# EAGLE design capstone (EAGLE 9.4.0)

## Sheet 1 of 6: Block Diagram
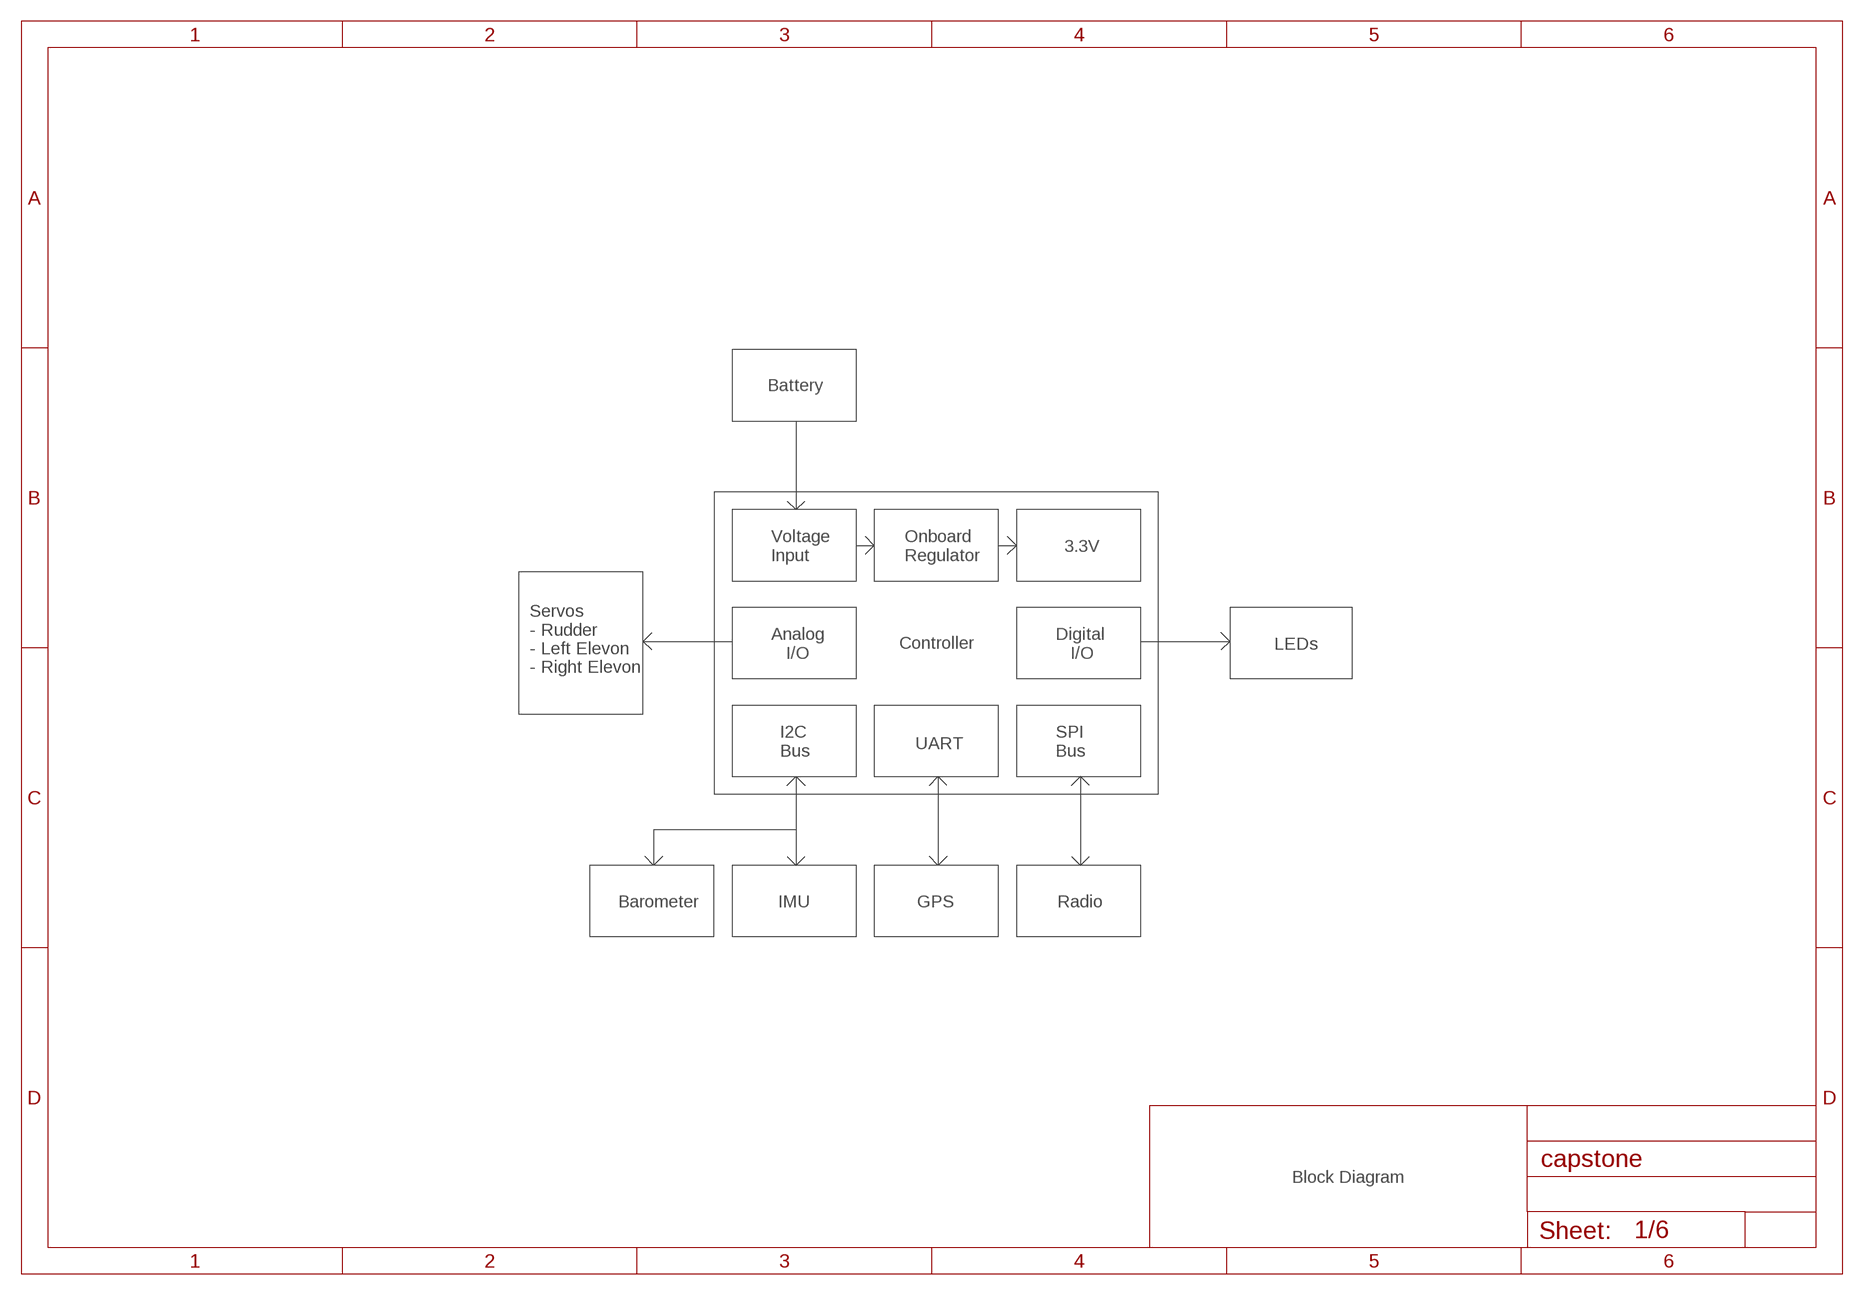
[diagram p0: schematic, sheet 1]

### Notes on the sheet
- Battery
- 3.3V
- Voltage
  Input
- Onboard
  Regulator
- LEDs
- Analog
     I/O
- Digital
     I/O
- Controller
- Servos
  - Rudder
  - Left Elevon
  - Right Elevon
- UART
- I2C
  Bus
- SPI
  Bus
- Barometer | IMU | GPS | Radio
- Block Diagram

## Sheet 2 of 6: Teensy 3.2 Connection
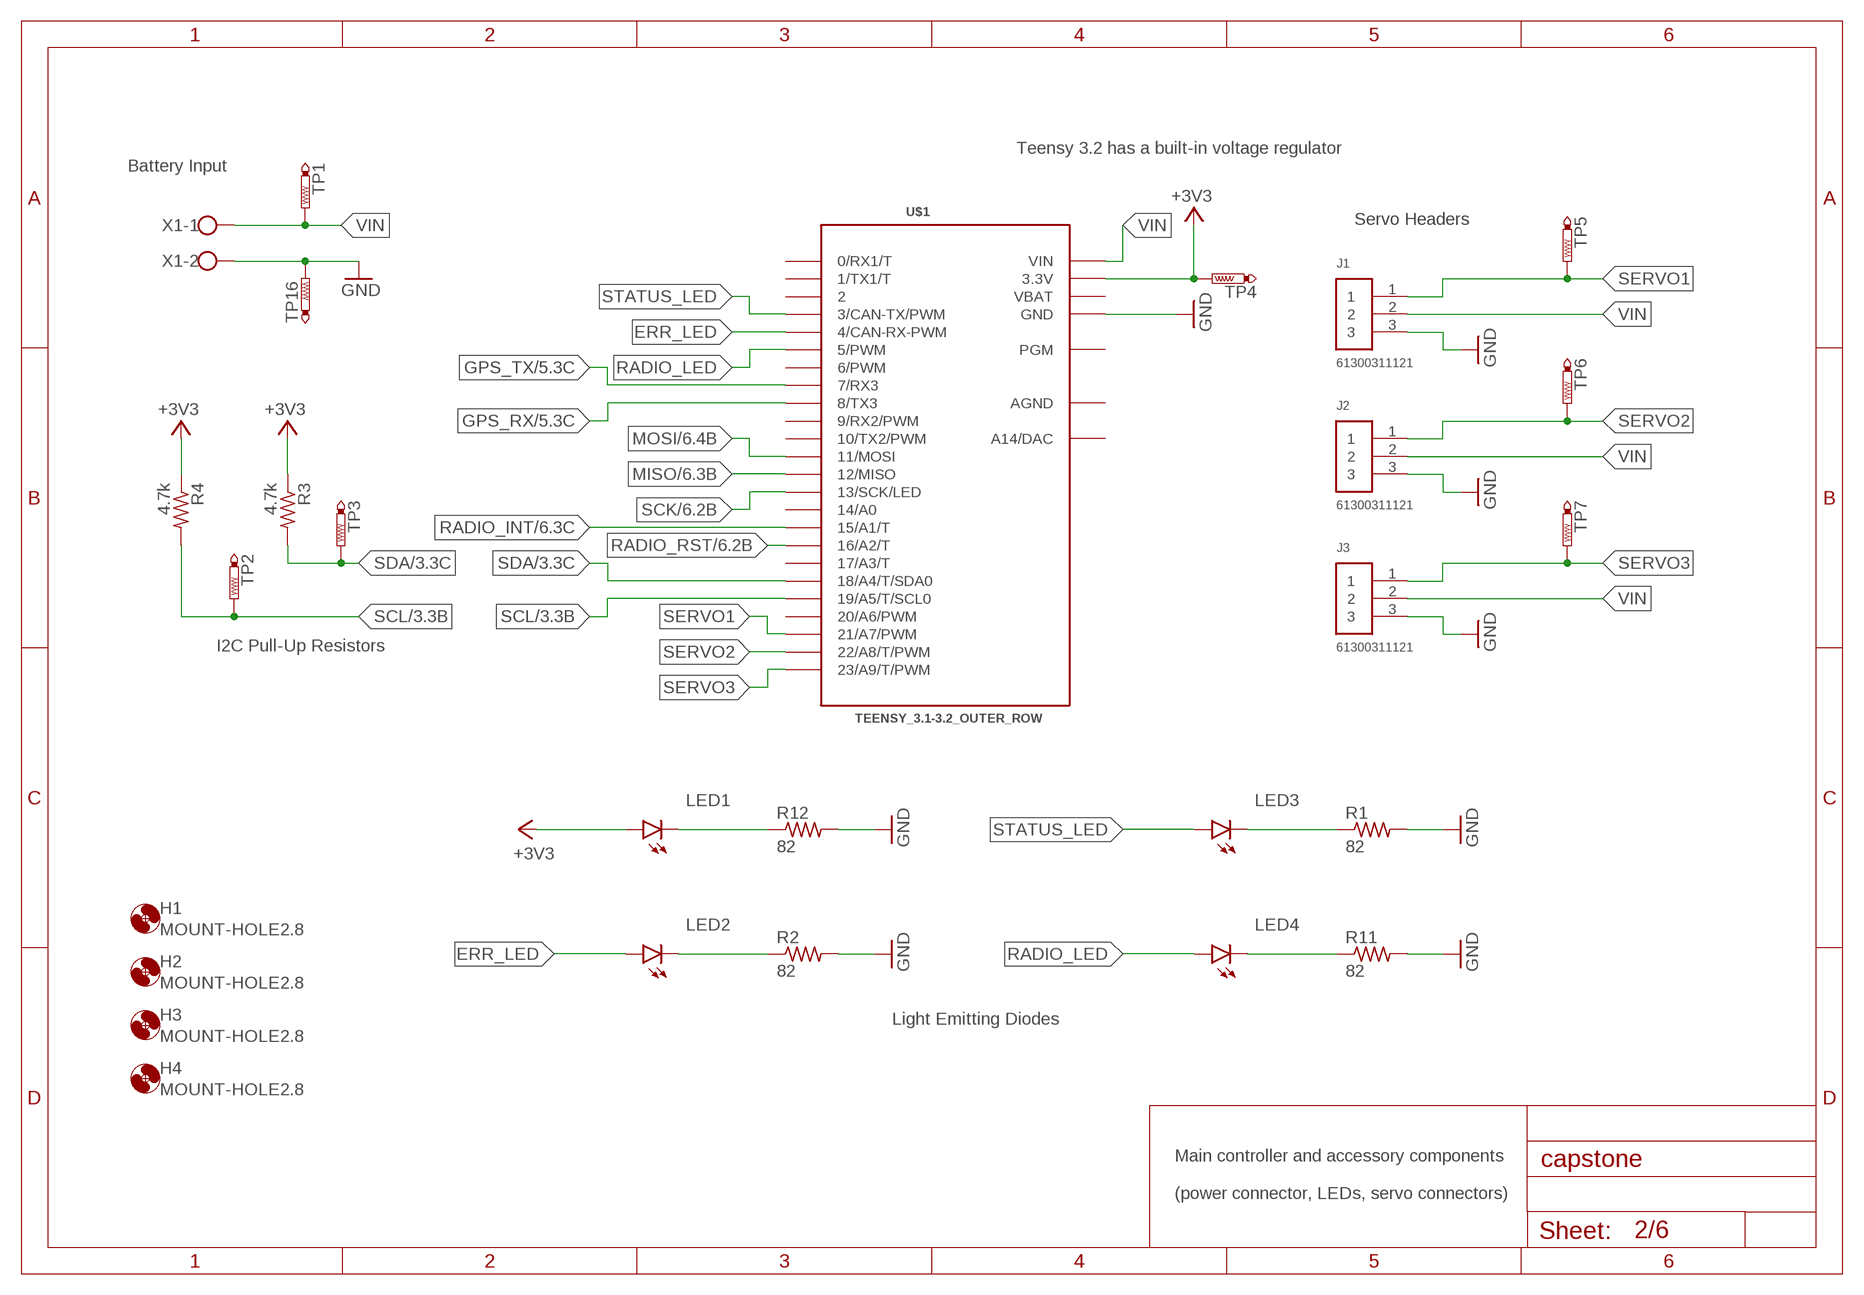
[diagram p1: schematic, sheet 2]

### Parts
H1  MOUNT-HOLE2.8  [2,8]
H2  MOUNT-HOLE2.8  [2,8]
H3  MOUNT-HOLE2.8  [2,8]
H4  MOUNT-HOLE2.8  [2,8]
J1  61300311121  [61300311121]
J2  61300311121  [61300311121]
J3  61300311121  [61300311121]
LED1  HSMH-C190  [LED-0603]
LED2  HSMH-C190  [LED-0603]
LED3  HSMH-C190  [LED-0603]
LED4  HSMH-C190  [LED-0603]
R1  82  R-US_R0603  [R0603]
R2  82  R-US_R0603  [R0603]
R3  4.7k  R-US_R0603  [R0603]
R4  4.7k  R-US_R0603  [R0603]
R11  82  R-US_R0603  [R0603]
R12  82  R-US_R0603  [R0603]
TP1  PTR1B1,27  [B1,27]
TP2  PTR1B1,27  [B1,27]
TP3  PTR1B1,27  [B1,27]
TP4  PTR1B1,27  [B1,27]
TP5  PTR1B1,27  [B1,27]
TP6  PTR1B1,27  [B1,27]
TP7  PTR1B1,27  [B1,27]
TP16  PTR1B1,27  [B1,27]
U$1  TEENSY_3.1-3.2_OUTER_ROW  [TEENSY_3.0-3.2&LC_OUTER_ROW]
X1  W237-102  [W237-102]

### Nets
+3V3: LED1.A R3.1 R4.1 TP4.TP U$1.3.3V U$1.3.3V1(3.3V) ; also sheet 3,4,5,6
ERR_LED: LED2.A U$1.4(4/CAN-RX-PWM)
GND: J1.3 J2.3 J3.3 R1.2 R2.2 R11.2 R12.2 TP16.TP U$1.GND U$1.GND1(GND) X1.2 ; also sheet 3,4,5,6
GPS_RX: U$1.8(8/TX3) ; also sheet 5
GPS_TX: U$1.7(7/RX3) ; also sheet 5
MISO: U$1.12(12/MISO) ; also sheet 6
MOSI: U$1.11(11/MOSI) ; also sheet 6
N$6: LED1.C R12.1
N$7: LED2.C R2.1
N$9: LED4.C R11.1
N$10: LED3.C R1.1
RADIO_INT: U$1.15/A1(15/A1/T) ; also sheet 6
RADIO_LED: LED4.A U$1.5(5/PWM)
RADIO_RST: U$1.16/A2(16/A2/T) ; also sheet 6
SCK: U$1.13(13/SCK/LED) ; also sheet 6
SCL: R4.2 TP2.TP U$1.19/A5(19/A5/T/SCL0) ; also sheet 3,4
SDA: R3.2 TP3.TP U$1.18/A4(18/A4/T/SDA0) ; also sheet 3,4
SERVO1: J1.1 TP5.TP U$1.21/A7(21/A7/PWM)
SERVO2: J2.1 TP6.TP U$1.22/A8(22/A8/T/PWM)
SERVO3: J3.1 TP7.TP U$1.23/A9(23/A9/T/PWM)
STATUS_LED: LED3.A U$1.3(3/CAN-TX/PWM)
VIN: J1.2 J2.2 J3.2 TP1.TP U$1.VIN X1.1
Unconnected: U$1.0(0/RX1/T) U$1.1(1/TX1/T) U$1.2 U$1.6(6/PWM) U$1.9(9/RX2/PWM) U$1.10(10/TX2/PWM) U$1.14/A0 U$1.17/A3(17/A3/T) U$1.20/A6(20/A6/PWM) U$1.PGM U$1.RESET/DAC(A14/DAC)

### Notes on the sheet
- Teensy 3.2 has a built-in voltage regulator
- Battery Input
- Servo Headers
- I2C Pull-Up Resistors
- Light Emitting Diodes
- Main controller and accessory components
  
  (power connector, LEDs, servo connectors)

## Sheet 3 of 6: BMP-388 Connection
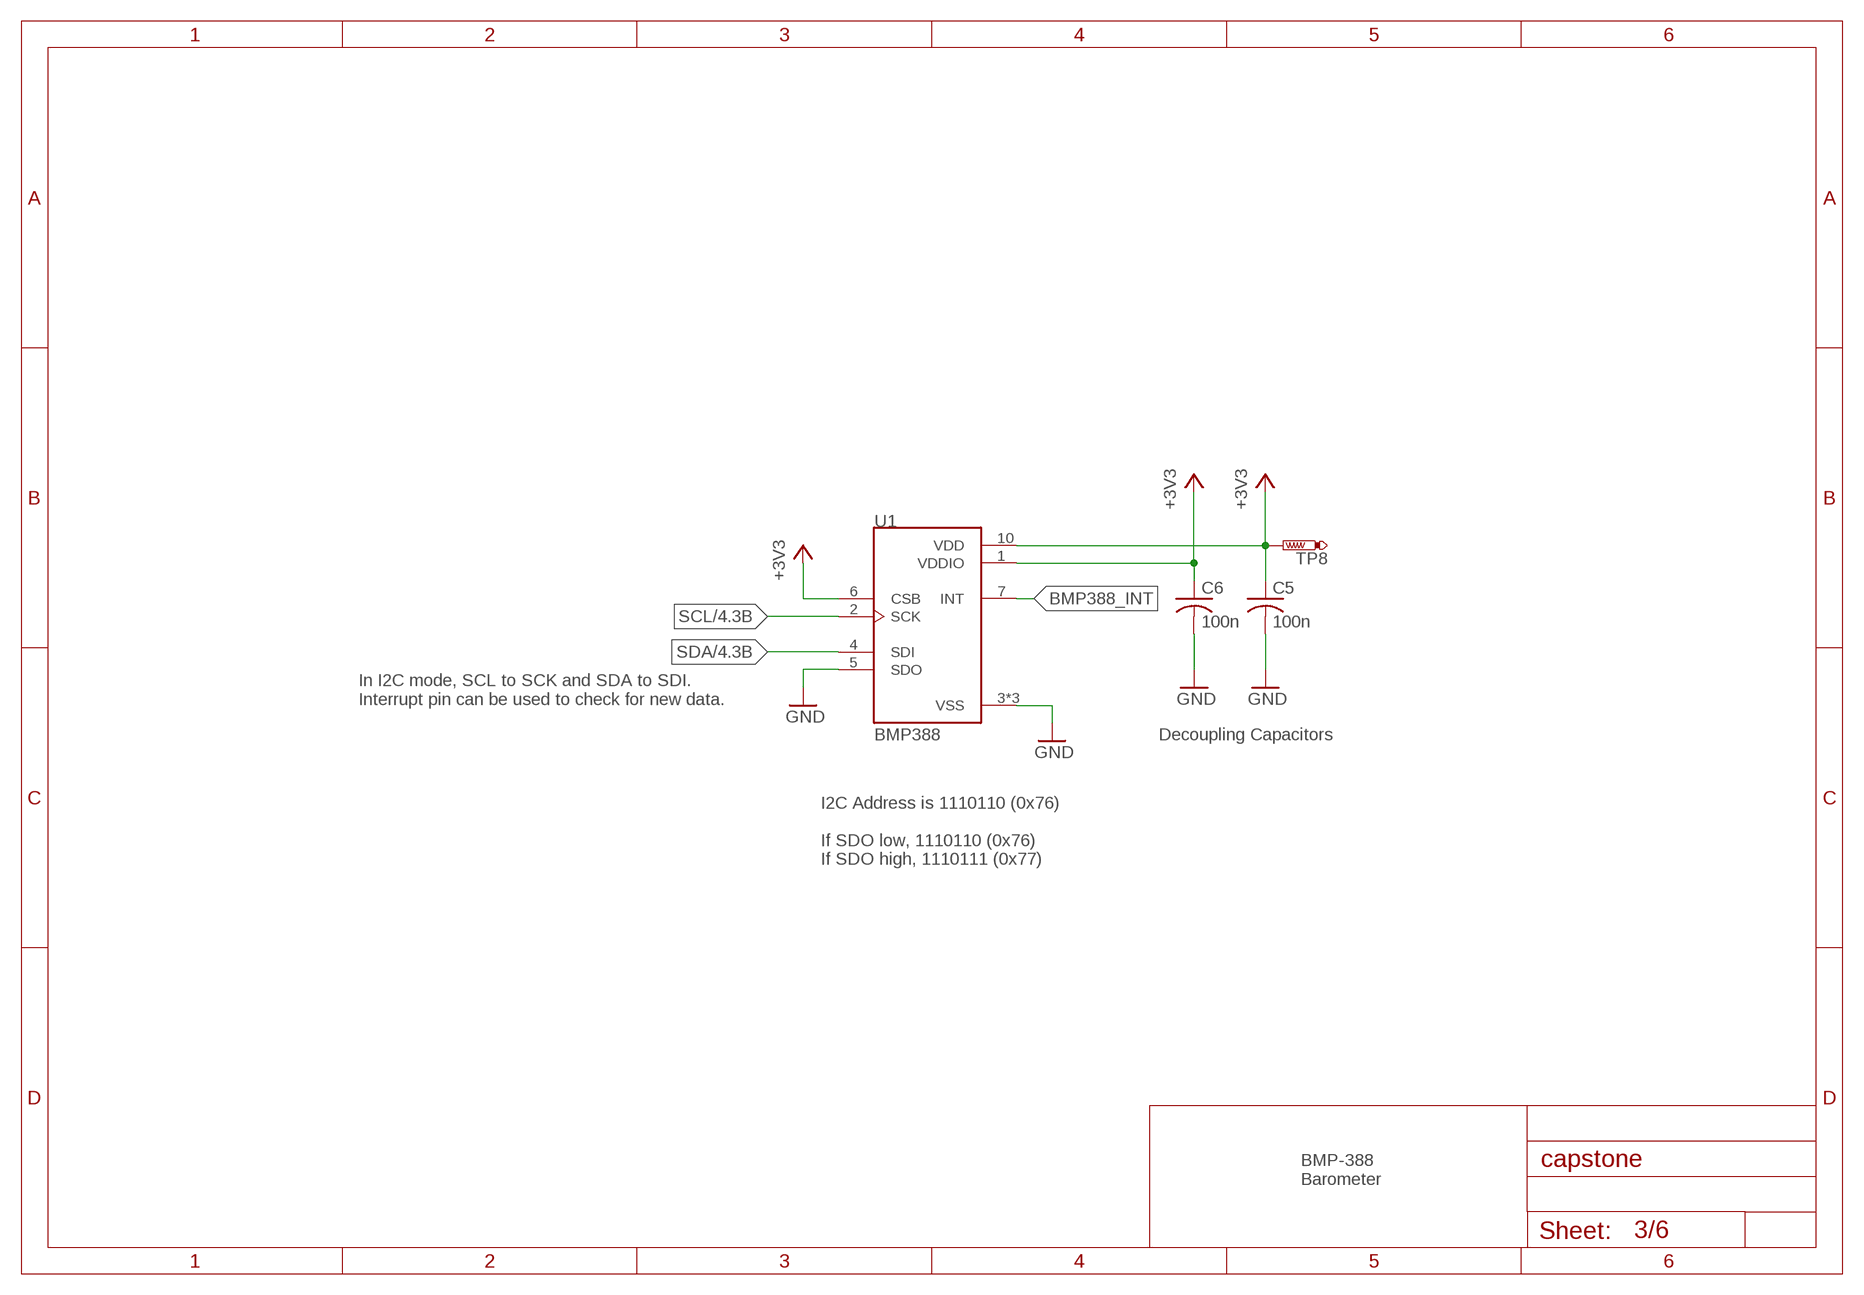
[diagram p2: schematic, sheet 3]

### Parts
C5  100n  C-USC0603  [C0603]
C6  100n  C-USC0603  [C0603]
TP8  PTR1B1,27  [B1,27]
U1  BMP388  [PQFN50P200X200X80-10N]

### Nets
+3V3: C5.1 C6.1 TP8.TP U1.1(VDDIO) U1.6(CSB) U1.10(VDD) ; also sheet 2,4,5,6
BMP388_INT: U1.7(INT)
GND: C5.2 C6.2 U1.3(VSS) U1.5(SDO) U1.8(VSS) U1.9(VSS) ; also sheet 2,4,5,6
SCL: U1.2(SCK) ; also sheet 2,4
SDA: U1.4(SDI) ; also sheet 2,4

### Notes on the sheet
- In I2C mode, SCL to SCK and SDA to SDI. 
  Interrupt pin can be used to check for new data.
- Decoupling Capacitors
- I2C Address is 1110110 (0x76)
  
  If SDO low, 1110110 (0x76)
  If SDO high, 1110111 (0x77)
- BMP-388
  Barometer

## Sheet 4 of 6: LSM9DS1 Connection
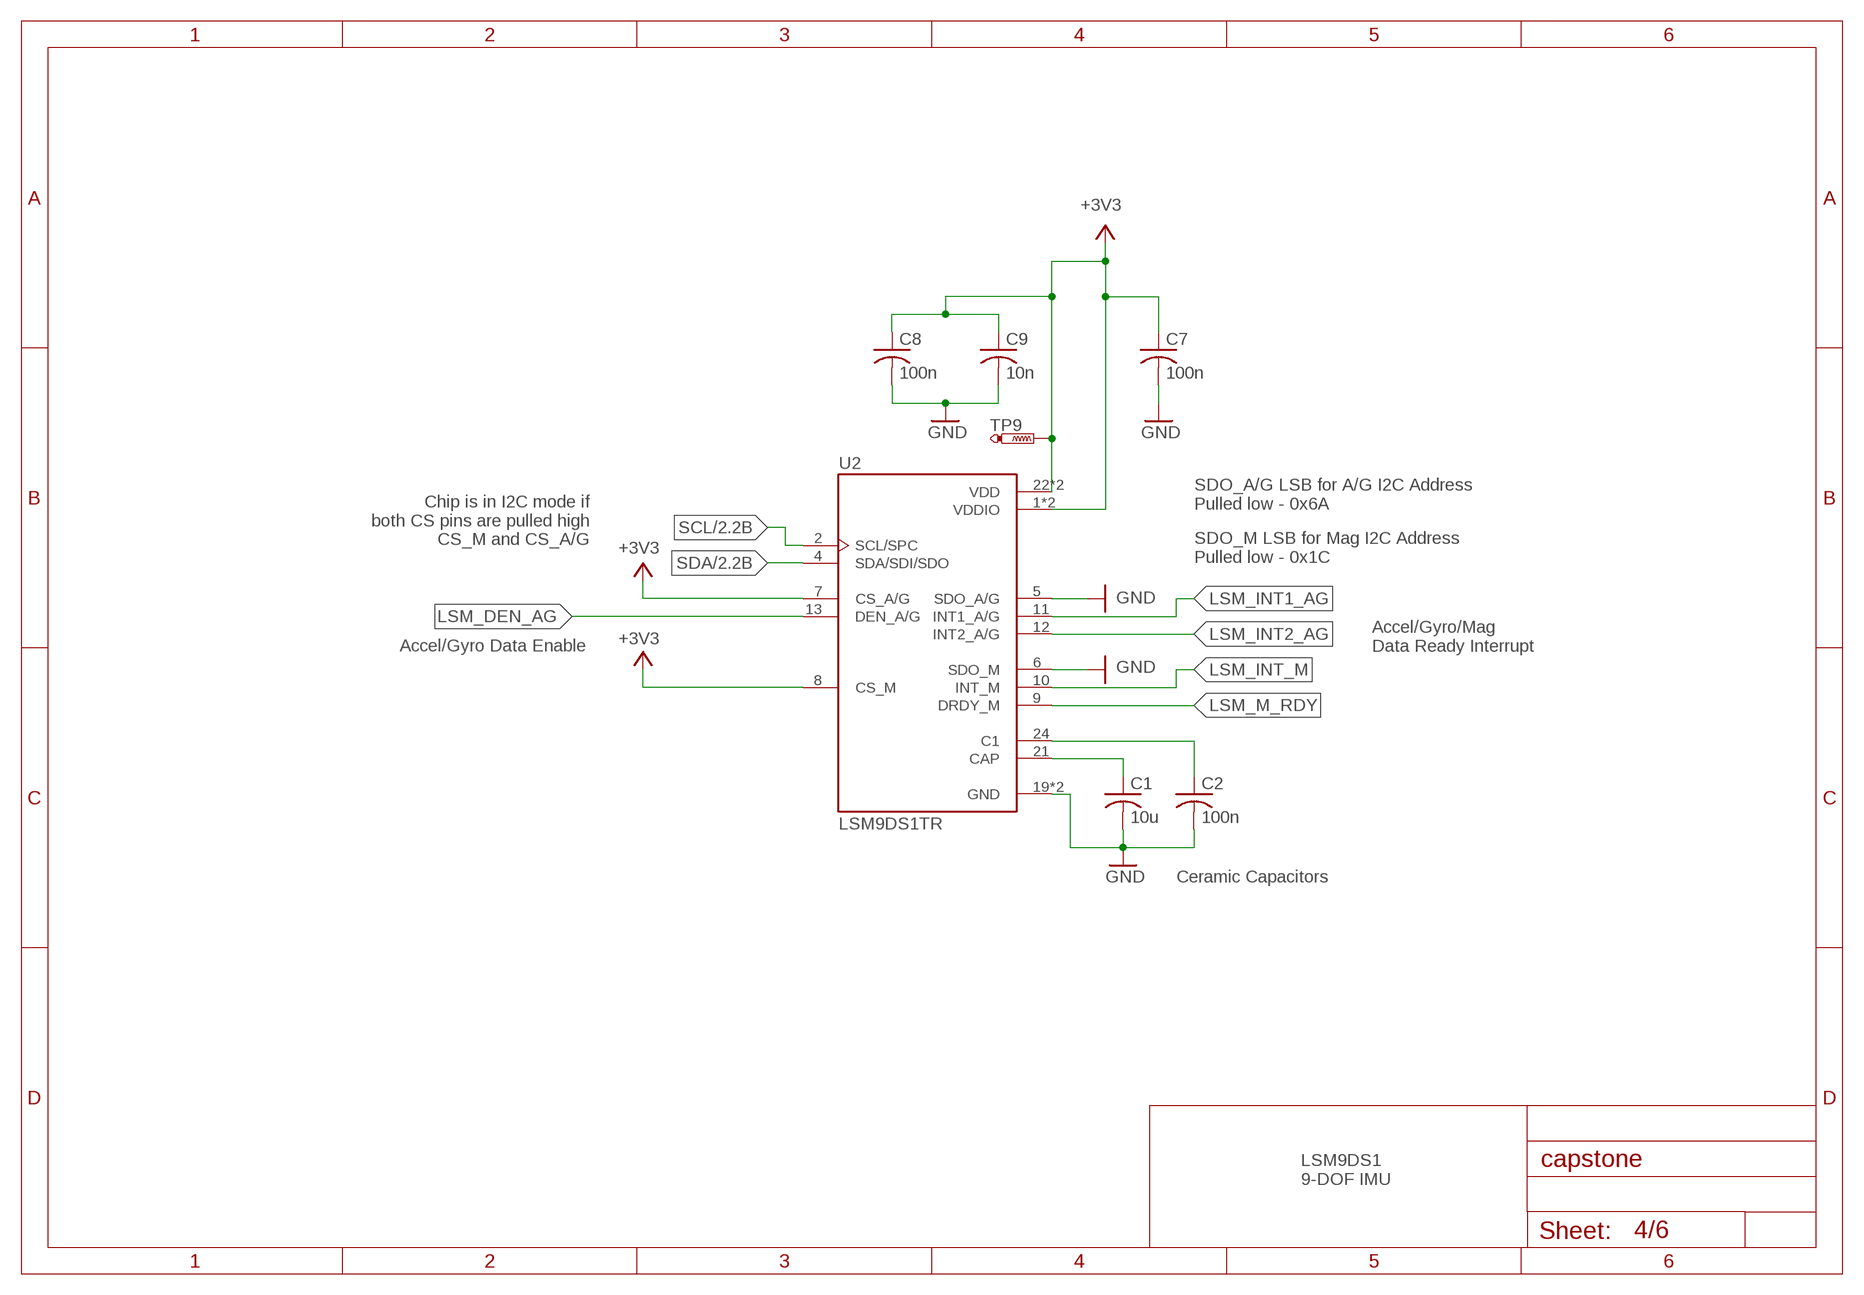
[diagram p3: schematic, sheet 4]

### Parts
C1  10u  C-USC0603  [C0603]
C2  100n  C-USC0603  [C0603]
C7  100n  C-USC0603  [C0603]
C8  100n  C-USC0603  [C0603]
C9  10n  C-USC0603  [C0603]
TP9  PTR1B1,27  [B1,27]
U2  LSM9DS1TR  [PQFN43P300X350X102-24N]

### Nets
+3V3: C7.1 C8.1 C9.1 TP9.TP U2.1(VDDIO) U2.3(VDDIO) U2.7(CS_A/G) U2.8(CS_M) U2.22(VDD) U2.23(VDD) ; also sheet 2,3,5,6
GND: C1.2 C2.2 C7.2 C8.2 C9.2 U2.5(SDO_A/G) U2.6(SDO_M) U2.19(GND) U2.20(GND) ; also sheet 2,3,5,6
LSM_DEN_AG: U2.13(DEN_A/G)
LSM_INT1_AG: U2.11(INT1_A/G)
LSM_INT2_AG: U2.12(INT2_A/G)
LSM_INT_M: U2.10(INT_M)
LSM_M_RDY: U2.9(DRDY_M)
N$1: C1.1 U2.21(CAP)
N$2: C2.1 U2.24(C1)
SCL: U2.2(SCL/SPC) ; also sheet 2,3
SDA: U2.4(SDA/SDI/SDO) ; also sheet 2,3

### Notes on the sheet
- SDO_A/G LSB for A/G I2C Address
  Pulled low - 0x6A
- Chip is in I2C mode if
  both CS pins are pulled high
  CS_M and CS_A/G
- SDO_M LSB for Mag I2C Address
  Pulled low - 0x1C
- Accel/Gyro Data Enable
- Accel/Gyro/Mag 
  Data Ready Interrupt
- Ceramic Capacitors
- LSM9DS1
  9-DOF IMU

## Sheet 5 of 6: MTK3399 Connection
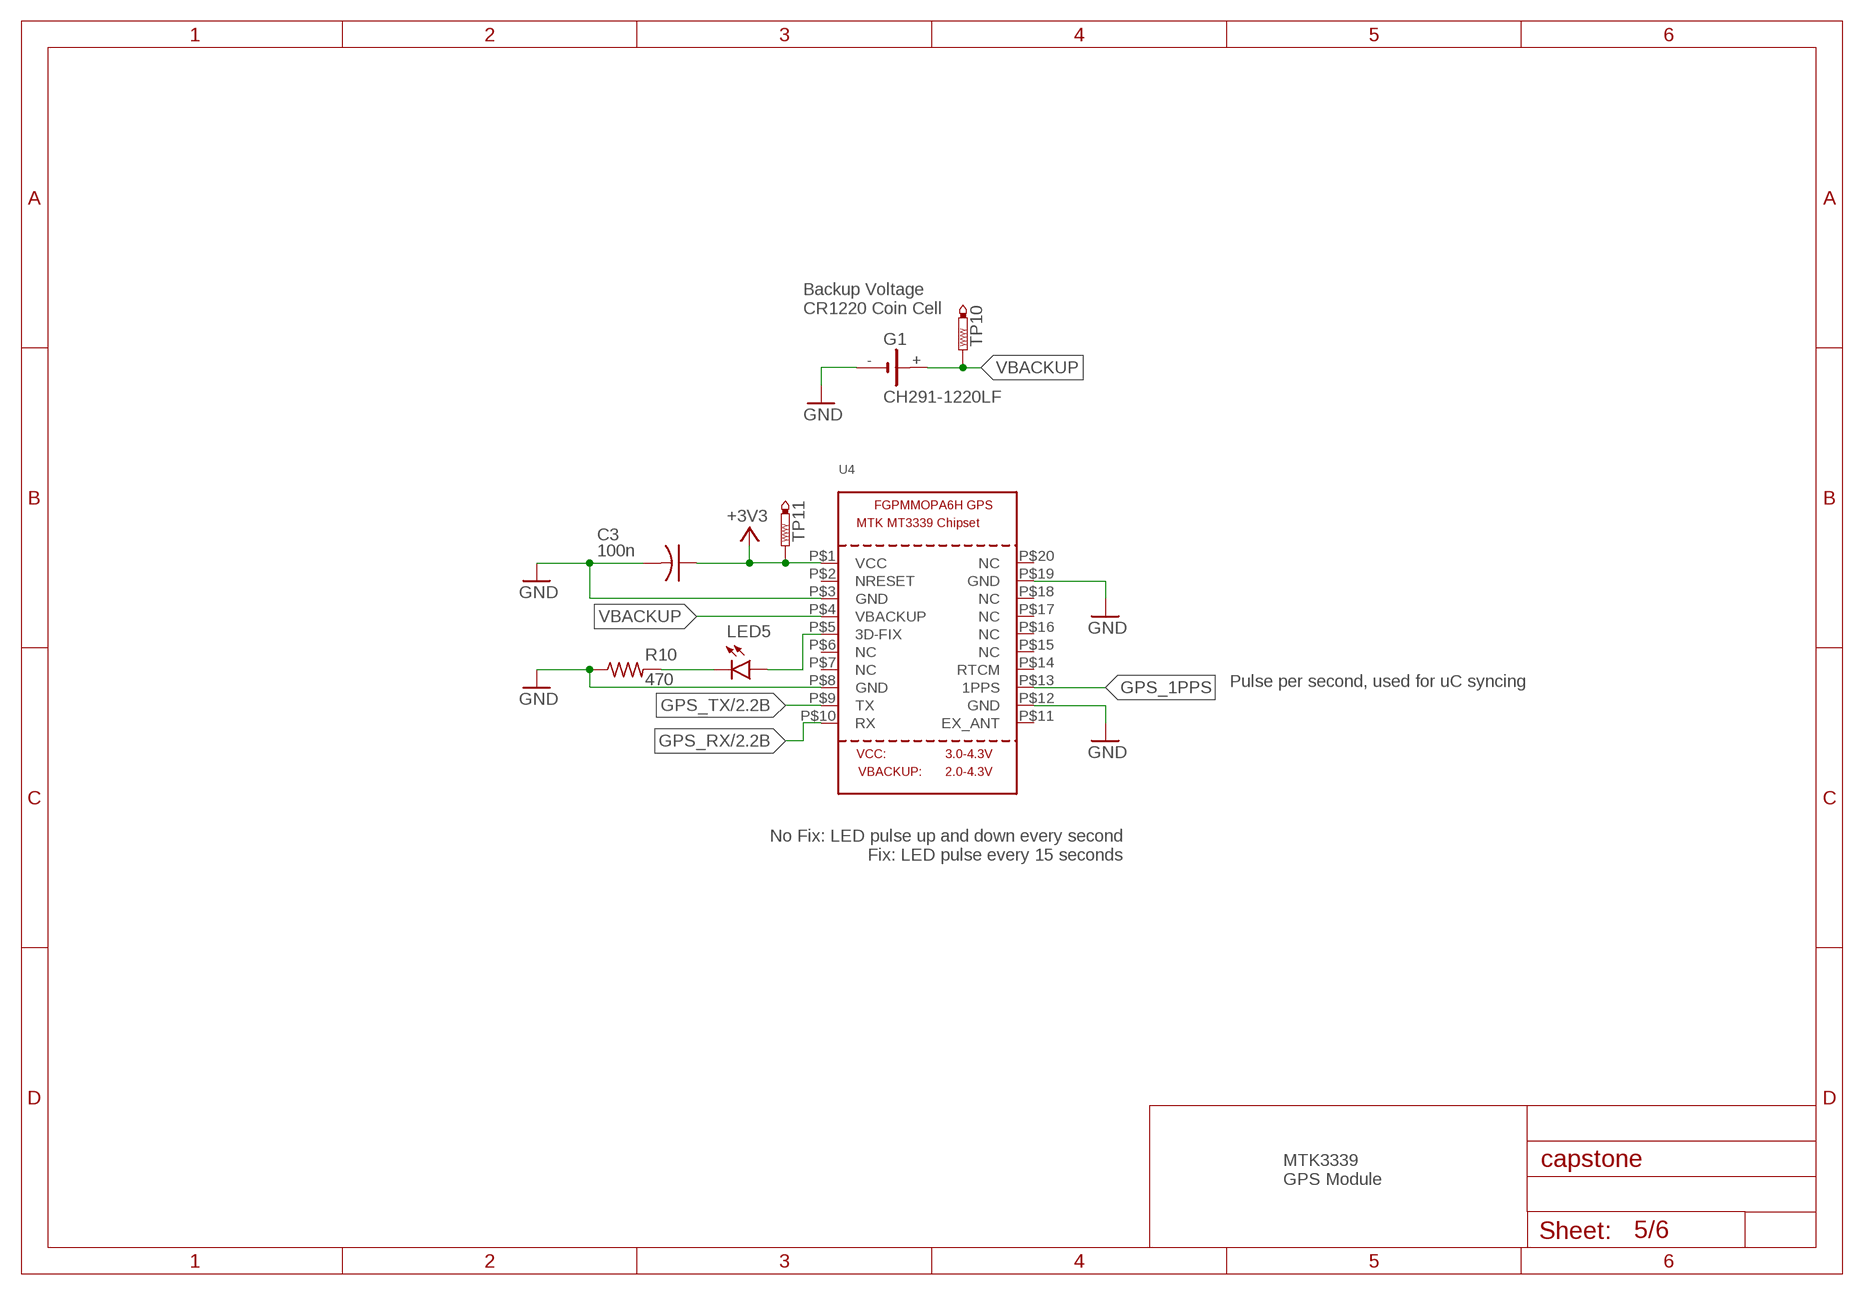
[diagram p4: schematic, sheet 5]

### Parts
C3  100n  C-USC0603  [C0603]
G1  CH291-1220LF  [CH291-1220LF]
LED5  HSMH-C190  [LED-0603]
R10  470  R-US_R0603  [R0603]
TP10  PTR1B1,27  [B1,27]
TP11  PTR1B1,27  [B1,27]
U4  GPS_FGPMMOPA6H  [FGPMMOPA6H]

### Nets
+3V3: C3.1 TP11.TP U4.P$1(VCC) ; also sheet 2,3,4,6
GND: C3.2 G1.- R10.1 U4.P$3(GND) U4.P$8(GND) U4.P$12(GND) U4.P$19(GND) ; also sheet 2,3,4,6
GPS_1PPS: U4.P$13(1PPS)
GPS_RX: U4.P$10(RX) ; also sheet 2
GPS_TX: U4.P$9(TX) ; also sheet 2
N$3: LED5.C R10.2
N$4: LED5.A U4.P$5(3D-FIX)
VBACKUP: G1.+ TP10.TP U4.P$4(VBACKUP)
Unconnected: U4.P$2(NRESET) U4.P$6(NC) U4.P$7(NC) U4.P$11(EX_ANT) U4.P$14(RTCM) U4.P$15(NC) U4.P$16(NC) U4.P$17(NC) U4.P$18(NC) U4.P$20(NC)

### Notes on the sheet
- Backup Voltage
  CR1220 Coin Cell
- Pulse per second, used for uC syncing
- No Fix: LED pulse up and down every second
  Fix: LED pulse every 15 seconds
- MTK3339
  GPS Module

## Sheet 6 of 6: RFM95W Connection
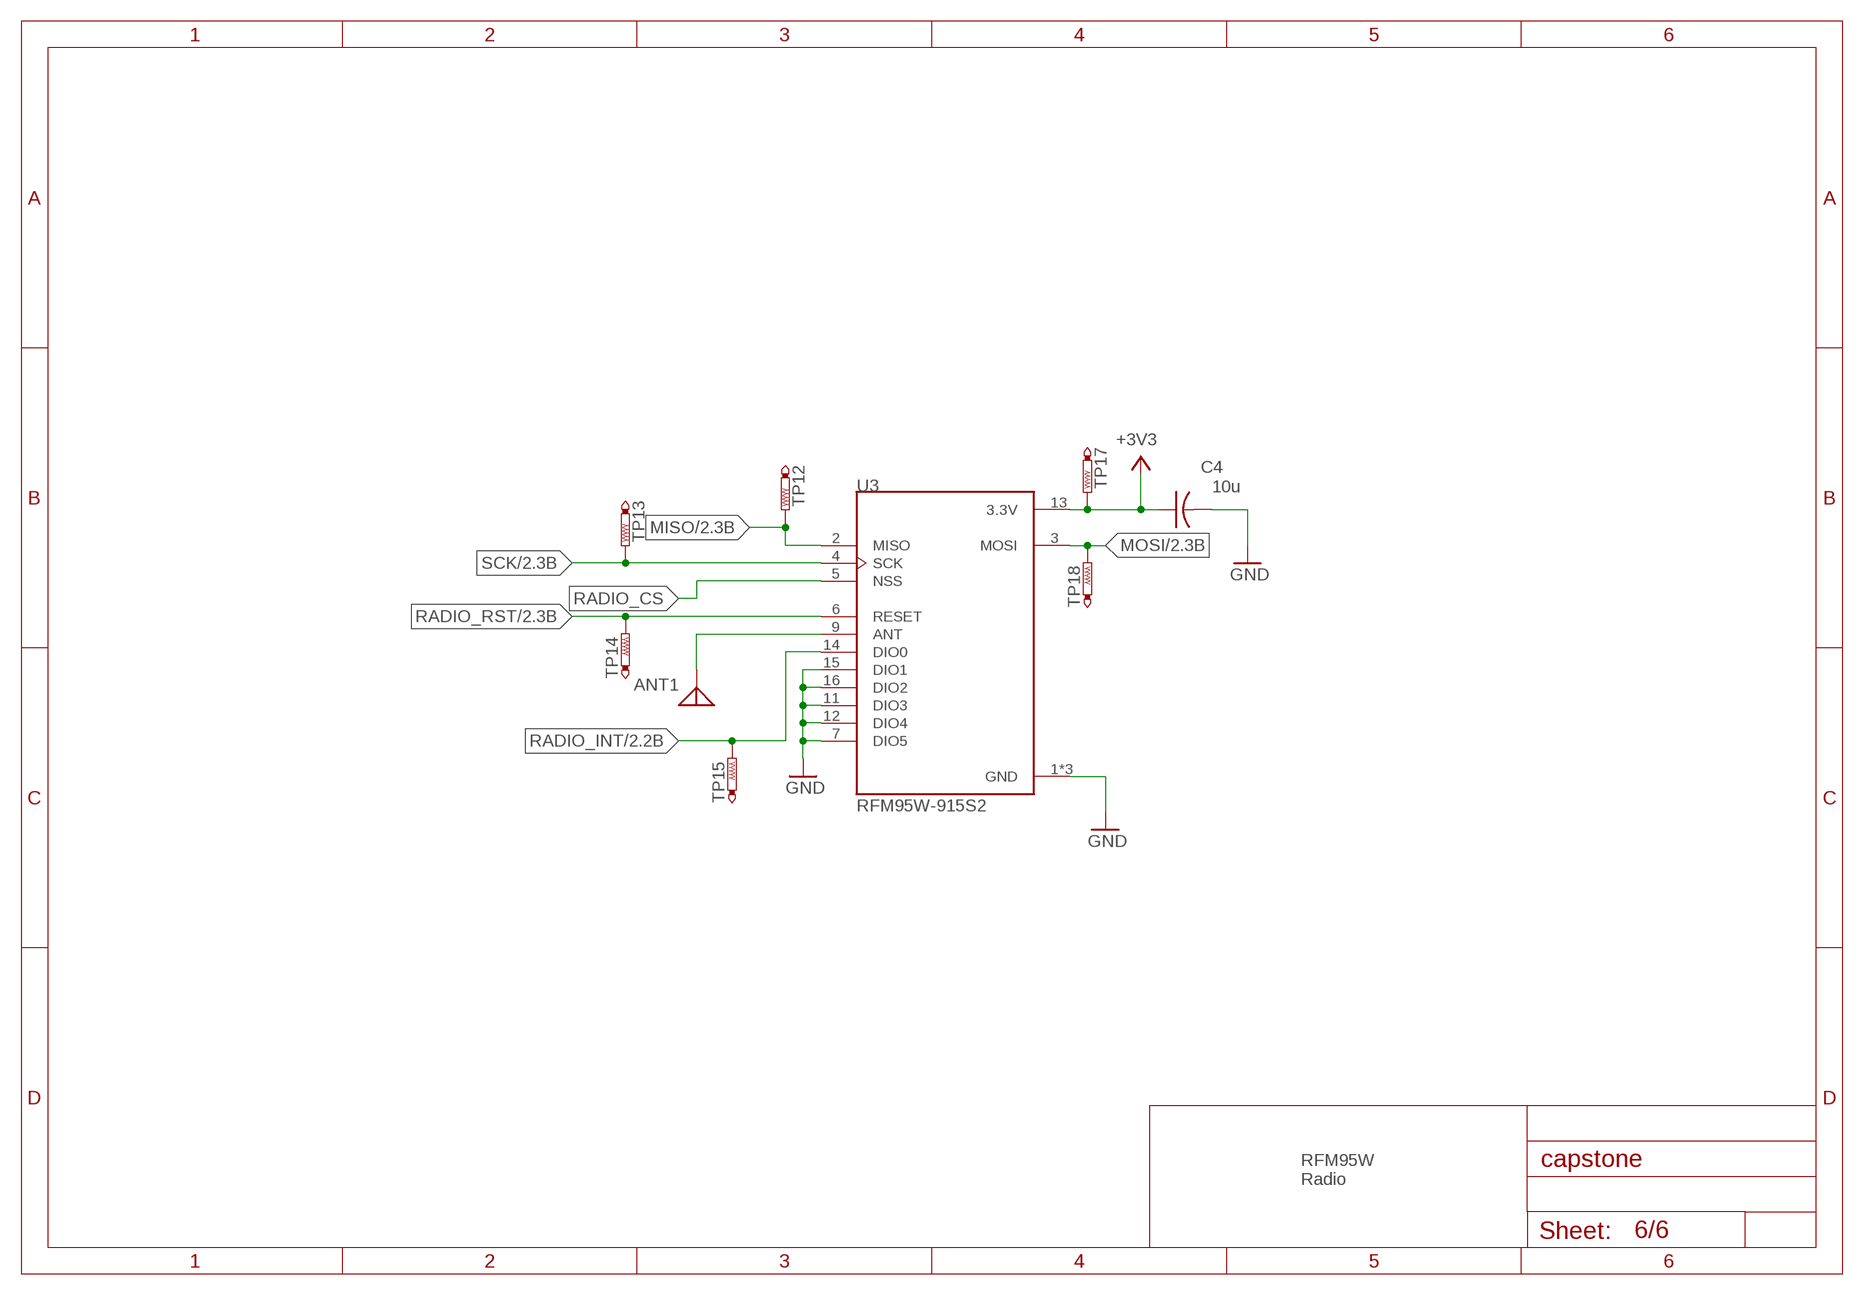
[diagram p5: schematic, sheet 6]

### Parts
ANT1  ANTENNA  [PAD-01]
C4  10u  C-USC0603  [C0603]
TP12  PTR1B1,27  [B1,27]
TP13  PTR1B1,27  [B1,27]
TP14  PTR1B1,27  [B1,27]
TP15  PTR1B1,27  [B1,27]
TP17  PTR1B1,27  [B1,27]
TP18  PTR1B1,27  [B1,27]
U3  RFM95W-915S2  [XCVR_RFM95W-915S2]

### Nets
+3V3: C4.1 TP17.TP U3.13(3.3V) ; also sheet 2,3,4,5
GND: C4.2 U3.1(GND) U3.7(DIO5) U3.8(GND) U3.10(GND) U3.11(DIO3) U3.12(DIO4) U3.15(DIO1) U3.16(DIO2) ; also sheet 2,3,4,5
MISO: TP12.TP U3.2(MISO) ; also sheet 2
MOSI: TP18.TP U3.3(MOSI) ; also sheet 2
N$5: ANT1.1 U3.9(ANT)
RADIO_CS: U3.5(NSS)
RADIO_INT: TP15.TP U3.14(DIO0) ; also sheet 2
RADIO_RST: TP14.TP U3.6(RESET) ; also sheet 2
SCK: TP13.TP U3.4(SCK) ; also sheet 2

### Notes on the sheet
- RFM95W
  Radio

## Power pins joined to a net without a drawn wire
AGND: U$1.AGND
VBAT: U$1.VBAT

## Library data of the parts
ANT1 = discrete:ANTENNA: Antenna
C1-C4 C7-C9 = resistor:C-US: CAPACITOR, American symbol
C5 C6 = rcl:C-US: CAPACITOR, American symbol; SPICEPREFIX: C
G1 = battery:CH291-1220LF: Battery Holder, SMT, 12mm multicomp PART NO. CH291-1220LF Source: Data sheet <http://www.farnell.com/datasheets/1505860.pdf>
H1-H4 = holes:MOUNT-HOLE: MOUNTING HOLE with drill center marker
J1-J3 = Headers:61300311121: CONN HEADER VERT 3POS 2.54MM Manufacturer's datasheet <https://katalog.we-online.de/em/datasheet/6130xx11121.pdf>; CREATED_BY: PCBLayout.com; DIGI_KEY_PART_NUMBER: 732-5316-ND; MANUFACTURER: Wurth Electronics Inc.; MPN: 61300311121
LED1-LED5 = LED:HSMH-C190: LED RED DIFFUSED CHIP SMD Manufacturer's datasheet <https://media.digikey.com/pdf/Data%20Sheets/Avago%20PDFs/HSMz-Czzz.pdf>; CREATED_BY: PCBLayout.com; DIGIKEY_PART_NUMBER: 516-1420-1-ND; MANUFACTURER: Broadcom Limited; MPN: HSMH-C190; PACKAGE: 0603
R1-R4 R10-R12 = resistor:R-US_: RESISTOR, American symbol
TP1-TP18 = testpad:PTR1: TEST PIN
U1 = BMP388:BMP388: P-Sensor SPI I2C 1, 25 Bar SMD; DESCRIPTION: P-Sensor SPI I2C 1, 25 Bar SMD; DIGI-KEY_PART_NUMBER: 828-1079-1-ND; DIGI-KEY_PURCHASE_URL: https://www.digikey.ca/product-detail/en/bosch-sensortec/BMP388/828-1079-1-ND/8322640?utm_source=snapeda&utm_medium=aggregator&utm_campaign=symbol; MF: Bosch Sensortec; MP: BMP388; PACKAGE: WFLGA-10 Bosch Tools
U2 = LSM9DS1TR:LSM9DS1TR: The LSM9DS1 is a system-in-package featuring a 3D digital linear acceleration sensor, a 3D digital angular rate sensor, and a 3D digital magnetic sensor.; DESCRIPTION: LSM9DS1 Series ±2/±4/±8/±16 g 3D Digital Linear Acceleration Sensor - LGA-24; DIGI-KEY_PART_NUMBER: 497-14946-1-ND; DIGI-KEY_PURCHASE_URL: https://www.digikey.ca/product-detail/en/stmicroelectronics/LSM9DS1TR/497-14946-1-ND/4988079?utm_source=snapeda&utm_medium=aggregator&utm_campaign=symbol; MF: STMicroelectronics; MP: LSM9DS1TR; PACKAGE: TFLGA-24 STMicroelectronics
U3 = RFM95W-915S2:RFM95W-915S2: RFM95(W) - Low Power Long Range Transceiver Module V1.0; DESCRIPTION: RFM95W LoRA Transceiver Module 915MHz; DIGI-KEY_PART_NUMBER: RFM95W-915S2-ND; DIGI-KEY_PURCHASE_URL: https://www.digikey.ca/product-detail/en/rf-solutions/RFM95W-915S2/RFM95W-915S2-ND/6564923?utm_source=snapeda&utm_medium=aggregator&utm_campaign=symbol; MF: RF Solutions; MP: RFM95W-915S2; PACKAGE: SMD-16 RF Solutions
U4 = adafruit:GPS_FGPMMOPA6H: GPS Module - MTK MT3339 Chipset, -165dBm sensitivity, 22 channels, 10Hz, auto-select external antenna options
U$1 = Teensy_3_and_LC_Series_Boards_v1.4:TEENSY_3.1-3.2_OUTER_ROW: Footprint for Teensy 3.1 or 3.2 board using all pin connections on the outer perimeter
X1 = con-wago-500:W237-102: WAGO SCREW CLAMP; MPN: 237-102; OC_FARNELL: unknown; OC_NEWARK: 70K9898

## Board
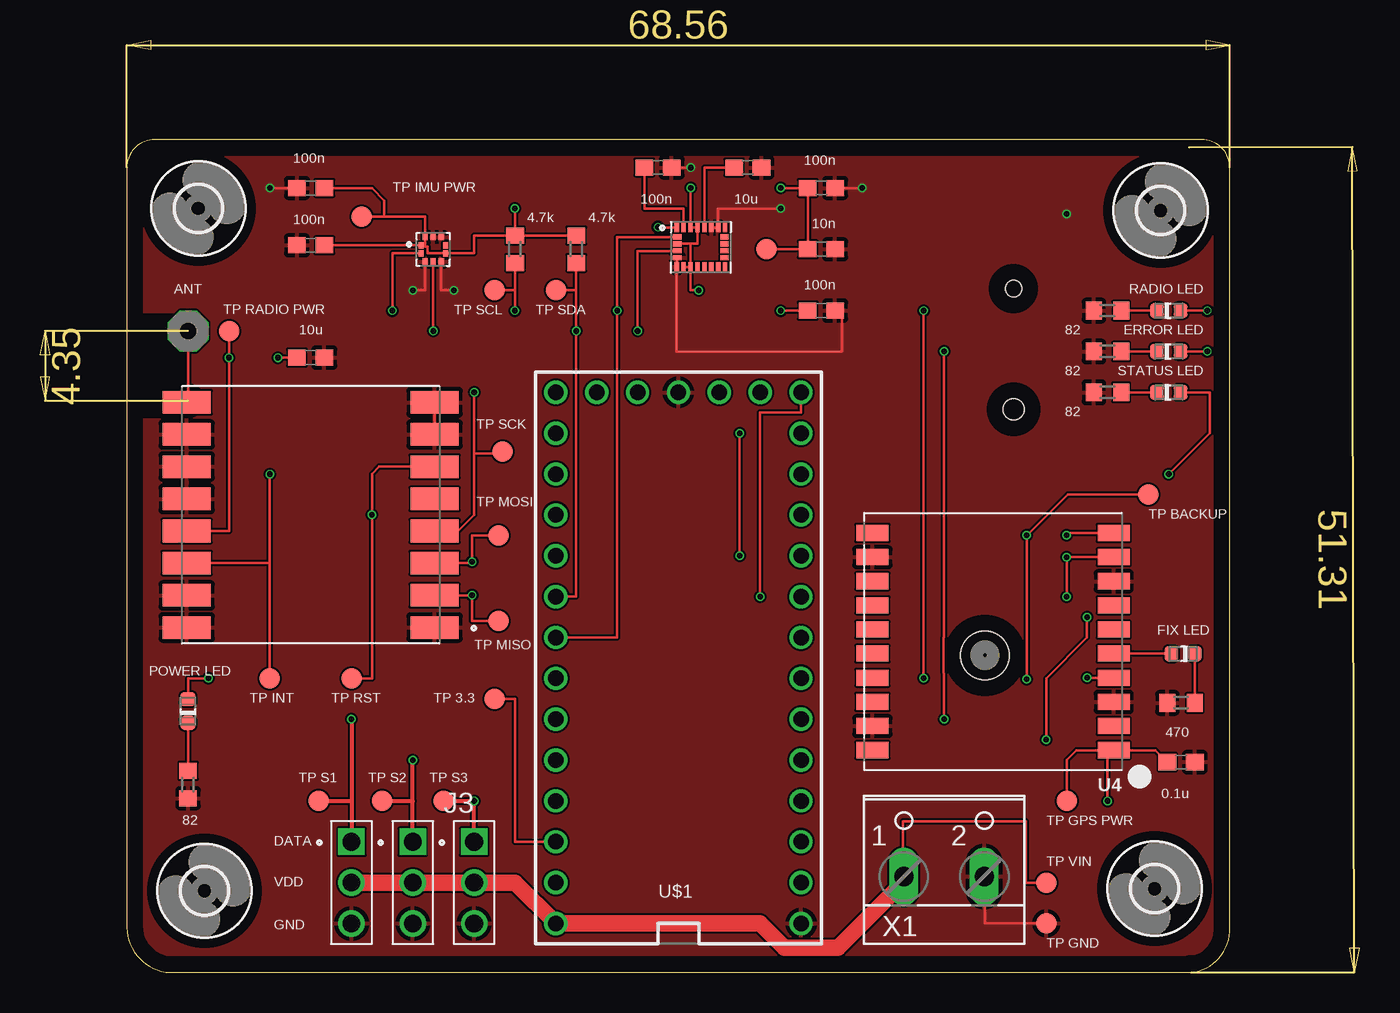
[diagram p6: board, top side]
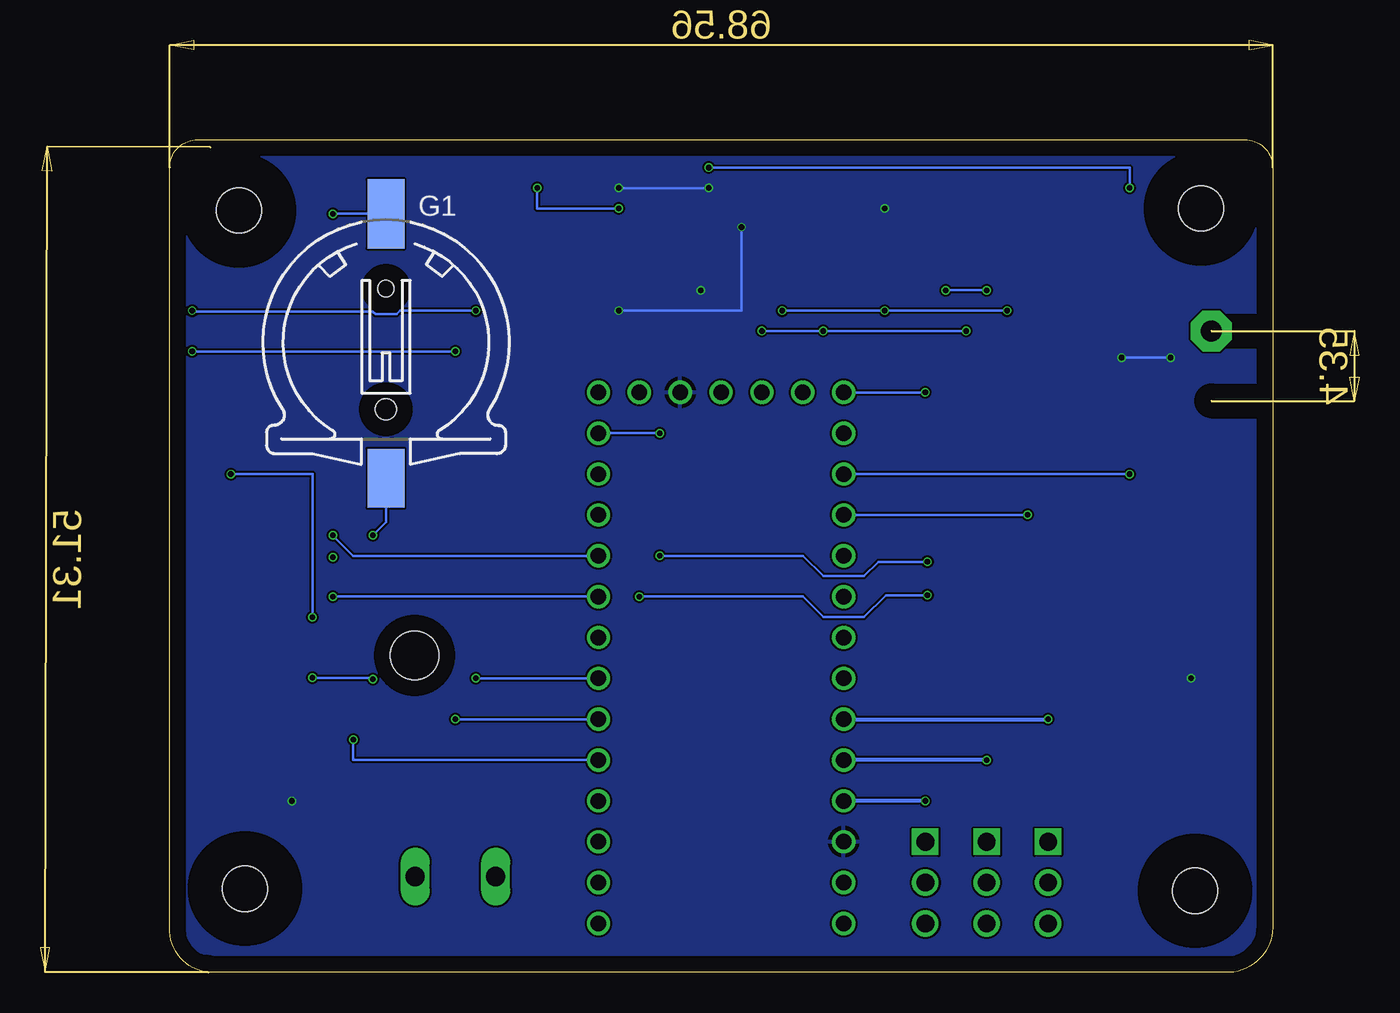
[diagram p7: board, bottom side, seen from below]

Size 68.58 x 51.78 mm. Coordinates in mm from the lower left corner, seen from the top.
Outline: 0.01,50.04 0.01,3.05 arc90 2.67,0 66.17,0 arc90 68.57,3.03 68.57,50.04 arc90 66.83,51.78 1.75,51.78 arc90 0.01,50.04
Copper layers (1*16): Top 0.035mm / dielectric 1.5mm / Bottom 0.035mm
Design rules "capstone-drc": minimum track width 5mil, minimum drill 0.2mm, track to track 5mil, track to pad 5mil, pad to pad 5mil, via to via 5mil, smd to smd 5mil, copper to edge 40mil, drill to drill 5mil, minimum pad ring 3mil, minimum via ring 3mil, stop-mask expansion 4mil, vias tented up to drill 0mil, thermal gap 10mil

### Footprints (pad centres in the part's own frame; a part is rotated, then mirrored left to right if it is on the bottom)
PAD-01 = drill 1.321 pad 2.54 octagon: 1 0,0
C0603 = smd 1.1 x 1: 1 -0.85,0; 2 0.85,0
CH291-1220LF = smd 2.3 x 3.66: + 0,-2.296 | smd 2.3 x 4.3: - 0,14.146 | hole 1.3: 0,2 | hole 1: 0,9.5
2,8 = hole 2.8: 0,0
61300311121 = drill 1.1 square: 1 -2.54,0 | drill 1.1: 2 0,0; 3 2.54,0
LED-0603 = smd 0.86 x 0.93: A 0.735,0; C -0.735,0
R0603 = smd 1 x 1.1: 1 -0.85,0; 2 0.85,0
B1,27 = smd 1.27 x 1.27: TP 0,0
PQFN50P200X200X80-10N = smd 0.35 x 0.38: 1 -0.765,0.25; 2 -0.765,-0.25; 3 -0.5,-0.765; 4 0,-0.765; 5 0.5,-0.765; 6 0.765,-0.25; 7 0.765,0.25; 8 0.5,0.765; 9 0,0.765; 10 -0.5,0.765
PQFN43P300X350X102-24N = smd 0.28 x 0.53: 1 -1.505,1.22; 6 -1.505,-1.22; 7 -1.075,-1.22; 8 -0.645,-1.22; 9 -0.215,-1.22; 10 0.215,-1.22; 11 0.645,-1.22; 12 1.075,-1.22; 13 1.505,-1.22; 18 1.505,1.22; 19 1.075,1.22; 20 0.645,1.22; 21 0.215,1.22; 22 -0.215,1.22; 23 -0.645,1.22; 24 -1.075,1.22 | smd 0.53 x 0.28: 2 -1.47,0.645; 3 -1.47,0.215; 4 -1.47,-0.215; 5 -1.47,-0.645; 14 1.47,-0.645; 15 1.47,-0.215; 16 1.47,0.215; 17 1.47,0.645
XCVR_RFM95W-915S2 = smd 3 x 1.4: 1 -7.7,7; 2 -7.7,5; 3 -7.7,3; 4 -7.7,1; 5 -7.7,-1; 6 -7.7,-3; 7 -7.7,-5; 8 -7.7,-7; 9 7.7,-7; 10 7.7,-5; 11 7.7,-3; 12 7.7,-1; 13 7.7,1; 14 7.7,3; 15 7.7,5; 16 7.7,7
FGPMMOPA6H = smd 2 x 1: P$1 -7.5,6.75; P$2 -7.5,5.25; P$3 -7.5,3.75; P$4 -7.5,2.25; P$5 -7.5,0.75; P$6 -7.5,-0.75; P$7 -7.5,-2.25; P$8 -7.5,-3.75; P$9 -7.5,-5.25; P$10 -7.5,-6.75; P$11 7.5,-6.75; P$12 7.5,-5.25; P$13 7.5,-3.75; P$14 7.5,-2.25; P$15 7.5,-0.75; P$16 7.5,0.75; P$17 7.5,2.25; P$18 7.5,3.75; P$19 7.5,5.25; P$20 7.5,6.75 | hole 3: 0.5,0.85
TEENSY_3.0-3.2&LC_OUTER_ROW = drill 0.965: 0 -7.62,13.97; 1 -7.62,11.43; 2 -7.62,8.89; 3 -7.62,6.35; 3.3V 7.62,11.43; 3.3V1 -2.54,-16.51; 4 -7.62,3.81; 5 -7.62,1.27; 6 -7.62,-1.27; 7 -7.62,-3.81; 8 -7.62,-6.35; 9 -7.62,-8.89; 10 -7.62,-11.43; 11 -7.62,-13.97; 12 -7.62,-16.51; 13 7.62,-16.51; 14/A0 7.62,-13.97; 15/A1 7.62,-11.43; 16/A2 7.62,-8.89; 17/A3 7.62,-6.35; 18/A4 7.62,-3.81; 19/A5 7.62,-1.27; 20/A6 7.62,1.27; 21/A7 7.62,3.81; 22/A8 7.62,6.35; 23/A9 7.62,8.89; AGND 7.62,13.97; GND -7.62,16.51; GND1 0,-16.51; PGM 2.54,-16.51; RESET/DAC 5.08,-16.51; VBAT -5.08,-16.51; VIN 7.62,16.51
W237-102 = drill 1.194 long: 1 -2.5,-1.27; 2 2.5,-1.27

### Placement (x,y rotation side)
ANT1  3.82,39.88 0 top
C1  10 u  [C0603]  38.61,50.04 0 top
C2  100 n  [C0603]  33.03,50.04 0 top
C3  0.1u  [C0603]  65.54,13.08 0 top
C4  10 u  [C0603]  11.44,38.23 0 top
C5  11.44,45.21 180 top
C6  11.44,48.77 180 top
C7  100 nF  [C0603]  43.19,41.15 0 top
C8  100 nF  [C0603]  43.19,48.77 0 top
C9  10 nF  [C0603]  43.19,44.96 0 top
G1  55.12,33.02 0 bottom
H1  4.45,47.5 0 top
H2  4.83,5.08 0 top
H3  63.89,5.21 0 top
H4  64.27,47.37 0 top
J1  13.98,5.59 270 top
J2  17.79,5.59 270 top
J3  21.6,5.59 270 top
LED1  3.82,16.26 90 top
LED2  64.78,38.61 0 top
LED3  64.78,36.07 0 top
LED4  64.78,41.15 0 top
LED5  65.66,19.81 180 top
R1  82 Ohm  [R0603]  60.97,36.07 180 top
R2  82 Ohm  [R0603]  60.97,38.61 180 top
R3  27.95,44.96 270 top
R4  24.14,44.96 270 top
R10  65.54,16.76 0 top
R11  82 Ohm  [R0603]  60.97,41.15 180 top
R12  82 Ohm  [R0603]  3.82,11.68 270 top
TP1  57.16,5.59 0 top
TP2  22.87,42.42 0 top
TP3  26.68,42.42 0 top
TP4  22.87,17.02 0 top
TP5  11.94,10.67 0 top
TP6  15.88,10.67 0 top
TP7  19.69,10.67 0 top
TP8  14.61,46.99 0 top
TP9  39.76,44.96 0 top
TP10  63.51,29.72 0 top
TP11  58.43,10.67 0 top
TP12  23.12,21.84 0 top
TP13  23.37,32.38 0 top
TP14  13.98,18.29 0 top
TP15  8.9,18.29 0 top
TP16  57.16,3.05 0 top
TP17  6.36,39.88 0 top
TP18  23.12,27.18 0 top
U1  19.06,44.96 0 top
U2  35.69,45.09 0 top
U3  11.44,28.45 180 top
U4  53.85,20.57 180 top
U$1  34.3,19.56 180 top
X1  50.81,7.24 0 top

### Tracks (layer width: path | path; a pad name or v marks a point on that pad's centre or on a via)
+3V3  (via drill 0.35)
  Top 0.152: U3.13 6.36,27.45 v6.36,38.23 TP17.TP | v9.4,38.23 C4.1 | C3.1 63.94,13.82 U4.P$1 | TP11.TP 58.43,13.21 59.04,13.82 U4.P$1 | 16.02,46.99 16.02,48 15.25,48.77 C6.1 | C5.1 U1.1 18.56,45.21 | TP8.TP 16.02,46.99 | 16.02,46.99 18.56,46.99 U1.10 18.56,45.21 | v35.06,48.77 v35.05,48.77 U2.23 U2.22 35.48,45.3 35.05,45.3 | v40.65,48.77 C8.1 C9.1 TP9.TP | U2.3 35.05,45.3 | U2.8 35.05,45.3 | U2.7 U2.8 | U2.1 33.03,46.3 v33.03,46.34 | C7.1 v40.65,41.15 | TP4.TP 24.14,17.02 24.14,8.13 U$1.3.3V | R3.1 R4.1 | R4.1 v24.14,47.5 | R4.1 21.6,45.81 21.6,44.71 U1.6 18.69,44.71 18.69,45.13 18.56,45.13 18.56,45.21 | U2.8 35.05,42.42 v35.57,42.42 | U4.P$1 60.97,13.82 v60.97,10.67 | LED1.A 3.82,18.29 v5.09,18.29
  Bottom 0.152: v6.36,38.23 v9.4,38.23 | v35.06,48.77 v40.65,48.77 | v33.03,46.34 33.03,41.15 v40.65,41.15
  pour Bottom: -2.53,53.85 -2.53,-0.76 71.13,-0.76 71.13,53.85
ERR_LED  (via drill 0.35)
  Top 0.152: v50.81,15.75 50.81,18.61 50.76,18.65 50.76,20.8 50.81,20.84 v50.81,38.61 | LED2.A v67.17,38.61
  Bottom 0.152: U$1.4 v50.81,15.75 | v67.17,38.61 v50.81,38.61
GND  (via drill 0.35)
  Top 0.152: U3.7 U3.8 | X1.2 53.35,5.97 53.35,3.05 TP16.TP | U2.5 34.22,43.87 U2.6 34.19,38.61 44.46,38.61 44.46,41.15 C7.2 | U2.20 U2.19 36.77,47.5 v40.65,47.5 | U1.3 18.56,42.42 v17.79,42.42 | v20.33,42.42 19.56,42.42 U1.5 | C2.2 v35.06,50.04 | v8.9,48.77 C6.2 | v45.73,48.77 C8.2
  Bottom 0.152: v17.79,42.42 v20.33,42.42 | v35.06,50.04 8.9,50.04 v8.9,48.77 | G1.- v58.43,47.17 | v40.65,47.5 45.73,47.5 v45.73,48.77
  pour Top: -1.26,52.58 -1.26,-2.03 69.86,-2.03 69.86,52.58
GPS_RX  (via drill 0.35)
  Top 0.152: v58.43,27.18 58.57,27.32 U4.P$10
  Bottom 0.152: U$1.8 57.16,25.91 v58.43,27.18
GPS_TX  (via drill 0.35)
  Top 0.152: U4.P$9 v58.43,25.82 v58.43,23.37
  Bottom 0.152: U$1.7 v58.43,23.37
MISO  (via drill 0.35)
  Top 0.152: v39.38,23.37 39.38,34.8 41.92,34.8 U$1.12 | U3.2 v21.47,23.45 21.47,21.84 TP12.TP
  Bottom 0.152: v21.47,23.45 24.06,23.45 25.41,22.1 27.95,22.1 29.22,23.37 v39.38,23.37
MOSI  (via drill 0.35)
  Top 0.152: U3.3 21.26,25.45 21.34,25.53 v21.47,25.53 21.47,27.18 TP18.TP | v38.11,25.91 v38.11,33.53
  Bottom 0.152: v21.47,25.53 24.52,25.53 25.41,24.64 27.95,24.64 29.22,25.91 v38.11,25.91 | v38.11,33.53 U$1.11
N$1
  Top 0.152: U2.21 35.91,50.04 C1.1
N$2
  Top 0.152: U2.24 34.62,47.5 32.18,47.5 C2.1
N$3
  Top 0.152: LED5.C 66.4,16.78 R10.2
N$4
  Top 0.152: U4.P$5 64.92,19.82 LED5.A
N$5
  Top 0.152: ANT1.1 3.82,35.53 U3.9
N$6
  Top 0.152: R12.1 LED1.C
N$7
  Top 0.152: R2.1 LED2.C
N$9
  Top 0.152: R11.1 LED4.C
N$10
  Top 0.152: R1.1 LED3.C
RADIO_INT  (via drill 0.35)
  Top 0.152: v8.9,30.99 8.9,25.45 | 8.9,25.45 U3.14 | TP15.TP 8.9,25.45
  Bottom 0.152: U$1.15/A1 v8.9,30.99
RADIO_LED  (via drill 0.35)
  Top 0.152: v49.54,41.15 v49.54,18.29 | LED4.A v67.17,41.15
  Bottom 0.152: v49.54,18.29 U$1.5 | v49.54,41.15 54.24,41.15 54.46,40.93 55.78,40.93 55.94,41.09 67.11,41.09 v67.17,41.15
RADIO_RST  (via drill 0.35)
  Top 0.152: U3.6 15.71,31.45 15.25,30.99 v15.25,28.45 15.25,18.29 TP14.TP
  Bottom 0.152: U$1.16/A2 v15.25,28.45
SCK  (via drill 0.35)
  Top 0.152: v21.6,36.07 21.6,32.26 | 21.6,32.26 21.6,28.45 20.33,27.18 19.41,27.18 U3.4 | TP13.TP 23.37,32.26 21.6,32.26
  Bottom 0.152: U$1.13 v21.6,36.07
SCL  (via drill 0.35)
  Top 0.152: U1.2 16.52,44.71 v16.52,41.15 | U$1.19/A5 30.49,20.83 v30.49,41.15 30.49,45.73 U2.2 | R4.2 24.14,42.42 | 24.14,42.42 v24.14,41.15 | TP2.TP 24.14,42.42
  Bottom 0.152: v16.52,41.15 v24.14,41.15 v30.49,41.15
SDA  (via drill 0.35)
  Top 0.152: U2.4 34.18,44.83 31.76,44.83 v31.76,39.88 | U$1.18/A4 27.95,23.37 v27.95,39.88 27.95,42.42 | U1.4 v19.06,39.88 | R3.2 27.95,42.42 | TP3.TP 27.95,42.42
  Bottom 0.152: v19.06,39.88 v27.95,39.88 v31.76,39.88
SERVO1  (via drill 0.35)
  Top 0.254: v13.98,15.75 13.98,10.67 | 13.98,10.67 J1.1 | TP5.TP 13.98,10.67
  Bottom 0.254: U$1.21/A7 v13.98,15.75
SERVO2  (via drill 0.35)
  Top 0.254: J2.1 17.79,10.67 | 17.79,10.67 v17.79,13.21 | TP6.TP 17.79,10.67
  Bottom 0.254: v17.79,13.21 U$1.22/A8
SERVO3  (via drill 0.35)
  Top 0.254: J3.1 v21.6,10.67 TP7.TP
  Bottom 0.254: v21.6,10.67 U$1.23/A9
STATUS_LED  (via drill 0.35)
  Top 0.152: v57.16,14.48 57.16,18.29 59.7,20.83 v59.7,22.1 | LED3.A 67.32,36.07 67.32,33.53 v64.78,30.99
  Bottom 0.152: U$1.3 57.16,13.21 v57.16,14.48 | v59.7,22.1 59.7,30.99 v64.78,30.99
VBACKUP  (via drill 0.35)
  Top 0.152: U4.P$4 v59.7,18.32 | v55.95,18.22 v55.95,27.18 58.49,29.72 TP10.TP
  Bottom 0.152: v59.7,18.32 56.05,18.32 v55.95,18.22 | v55.95,27.18 55.12,28 G1.+
VIN
  Top 0.152: TP1.TP 55.89,5.59 55.89,9.4 48.27,9.4 48.27,5.67 48.31,5.63
  Top 1.016: J1.2 J2.2 J3.2 24.14,5.59 U$1.VIN 39.38,3.05 40.9,1.52 44.2,1.52 48.31,5.63 X1.1

### Text on the board
tNames: 100n | 100n | TP IMU PWR | 100n | 10u | 100n | 4.7k | 4.7k | 10n | 100n | ANT | RADIO LED | TP RADIO PWR | 10u | TP SCL | TP SDA | 82 | ERROR LED | 82 | STATUS LED | 82 | TP SCK | TP MOSI | TP BACKUP | FIX LED | TP MISO | POWER LED | TP INT | TP RST | TP 3.3 | 470 | TP S1 | TP S2 | TP S3 | 0.1u | 82 | TP GPS PWR | DATA | TP VIN | VDD | GND | TP GND